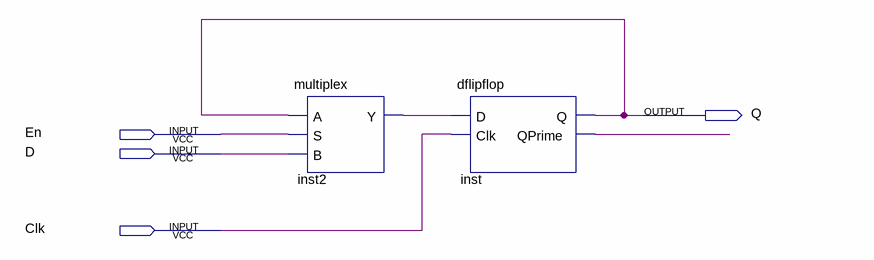
[diagram p0: schematic sheet]
// Quartus schematic enableddflipflop.bdf as structural Verilog: 2 symbols, 4 pins
module enableddflipflop (
  input  En,
  input  D,
  input  Clk,
  output Q
);

  wire inst2_y, inst_qprime;

  multiplex inst2 (.A(Q), .S(En), .B(D), .Y(inst2_y));
  dflipflop inst (.D(inst2_y), .Clk(Clk), .Q(Q), .QPrime(inst_qprime));
endmodule
